# Altium schematic sheet Sheet_2023-02-18.schdoc
size 203 x 120 mm
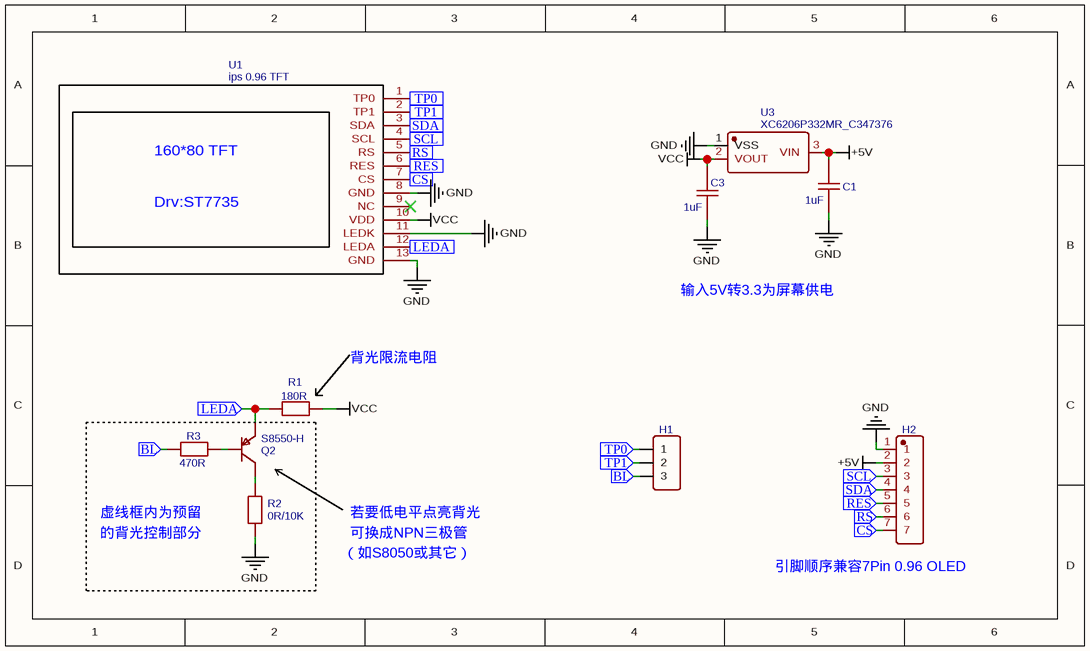
[diagram p0: Sheet_2023-02-18.schdoc]

## Parts
C1  1uF  [0603_C_JX]
C3  1uF  [0603_C_JX]
H1  HDR-F-2.54_1x3  [0.96引脚]  (value not drawn)
H2  排针2.54-7P  [SIP-2.54MM-7P-CJT-H8.54]  (value not drawn)
Q2  S8550-H  [SOT-23-3_L2.9-W1.3-P1.90-LS2.4-BR]
R1  180R  [R0603]
R2  0R/10K  [R0603]
R3  470R  [R0603]
U1  ips 0.96 TFT  [IPS0.96TFT]
U3  XC6206P332MR_C347376  [SOT-23-3_L3.0-W1.7-P0.95-LS2.9-BR]

## Ports
BL (in), CS (in), LEDA (in), RES (in), RS (in), SCL (in), SDA (in), TP0 (in), TP1 (in)

## Nets
+5V: C1.2 H2.2 U3.3(VIN)
GND: C1.1 C3.1 H2.1 R2.1 U1.8(GND) U1.11(LEDK) U1.13(GND) U3.1(VSS)
VCC: C3.2 R1.2 U1.10(VDD) U3.2(VOUT)
BL: H1.3 R3.2 ; port BL
CS: H2.7 U1.7(CS) ; port CS
LEDA: Q2.2(E) R1.1 U1.12(LEDA) ; port LEDA
RES: H2.5 U1.6(RES) ; port RES
RS: H2.6 U1.5(RS) ; port RS
SCL: H2.3 U1.4(SCL) ; port SCL
SDA: H2.4 U1.3(SDA) ; port SDA
TP0: H1.1 U1.1(TP0) ; port TP0
TP1: H1.2 U1.2(TP1) ; port TP1
NetQ2_1: Q2.1(B) R3.1
NetQ2_3: Q2.3(C) R2.2

Not connected (* = marked no-connect by the designer): U1 9(NC)*

## Notes on the sheet
- 输入5V转3.3为屏幕供电
- 背光限流电阻
- 的背光控制部分
- 虚线框内为预留
- 若要低电平点亮背光
- 可换成NPN三极管
- （如S8050或其它）
- (near H2) 引脚顺序兼容7Pin 0.96 OLED
- (in symbol ips 0.96 TFT) 160*80 TFT; Drv:ST7735

## Library data of the parts
C1 C3 = 1uF: nameAlias: Value(F); spicePre: C; spiceSymbolName: Capacitor; BOM_Supplier: LCSC
H1 = HDR-F-2.54_1x3: Contributor: LCEDA_Lib; BOM_Supplier Part: C146690; BOM_Supplier: LCSC; spicePre: H; spiceSymbolName: HDR-F-2.54_1x3
H2 = 排针2.54-7P: BOM_Manufacturer: Changjiang Connectors; BOM_Manufacturer Part: A2541WV-7P; Contributor: LCSC; BOM_Supplier: LCSC; BOM_Supplier Part: C225482; spicePre: H; spiceSymbolName: 排针2.54-7P
Q2 = S8550-H: BOM_Manufacturer: Yangzhou Yangjie Elec Tech; Contributor: LCSC; BOM_Supplier: LCSC; BOM_Supplier Part: C699225; BOM_Manufacturer Part: S8550-H; BOM_JLCPCB Part Class: Extended Part; spicePre: Q; spiceSymbolName: S8550-H
R1 = 180R: nameAlias: Value(Ω); Contributor: LCEDA_Lib; spicePre: R; spiceSymbolName: R_0603_EU
R2 = 0R/10K: nameAlias: Value(Ω); Contributor: LCEDA_Lib; spicePre: R; spiceSymbolName: R_0603_EU
R3 = 470R: nameAlias: Value(Ω); Contributor: LCEDA_Lib; spicePre: R; spiceSymbolName: R_0603_EU
U1 = ips 0.96 TFT: BOM_Manufacturer Part: FP-096H01B; Contributor: wangshujun; link: https://item.taobao.com/item.htm?spm=a1z10.5-c-s.w4002-17882464379.12.706a5f24NSzjKm&id=565271827736; spicePre: U; spiceSymbolName: ips 0.96 TFT
U3 = XC6206P332MR_C347376: BOM_Manufacturer: Youtai Semiconductor Co., Ltd.; Contributor: LCSC; BOM_Supplier: LCSC; BOM_Supplier Part: C347376; BOM_Manufacturer Part: XC6206P332MR; BOM_JLCPCB Part Class: Extended Part; spicePre: U; spiceSymbolName: XC6206P332MR_C347376